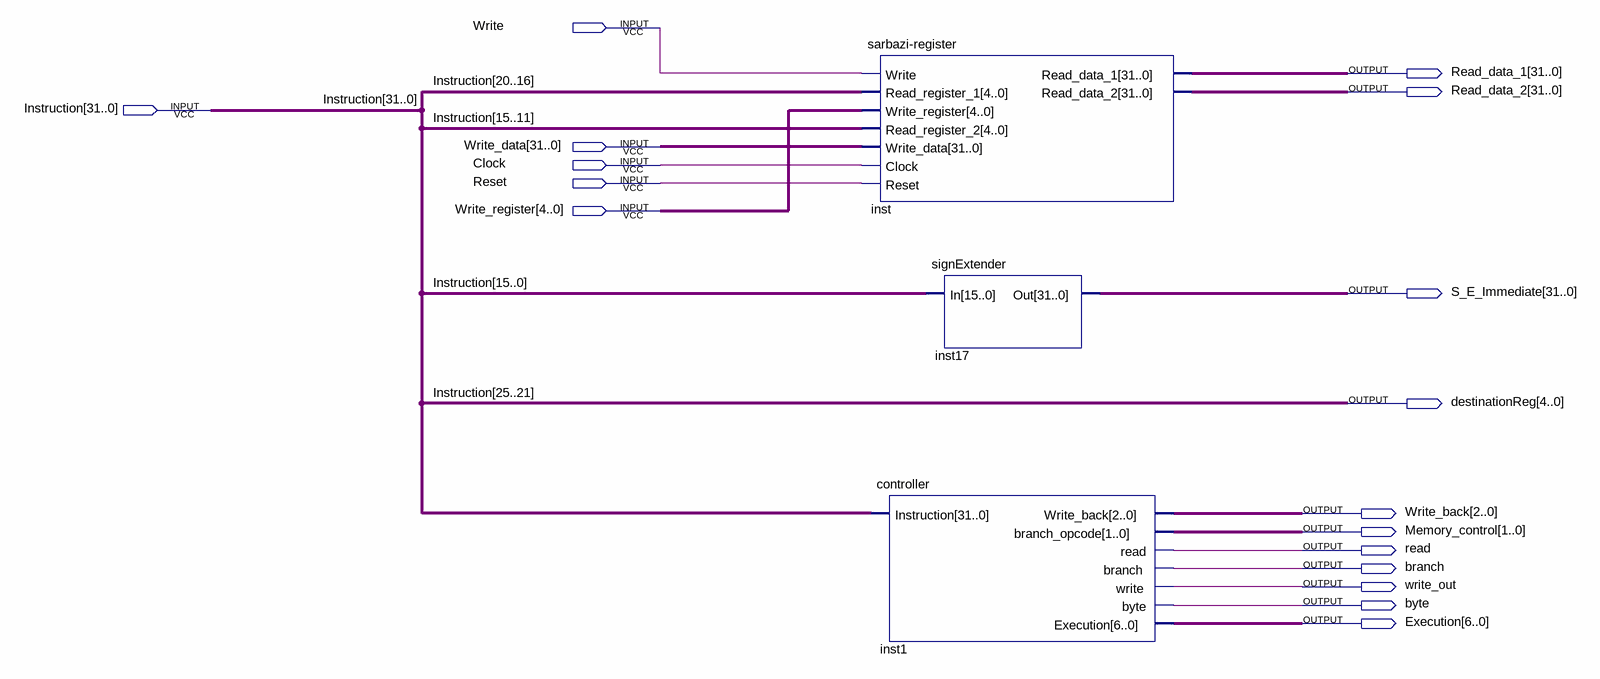
[diagram p0: schematic sheet]
// Quartus schematic instDecodeLEVEL.bdf as structural Verilog: 3 symbols, 17 pins
module instDecodeLEVEL (
  input  Write,
  input  [31:0] Instruction,
  input  [31:0] Write_data,
  input  Clock,
  input  Reset,
  input  [4:0] Write_register,
  output [31:0] Read_data_1,
  output [31:0] Read_data_2,
  output [31:0] S_E_Immediate,
  output [4:0] destinationReg,
  output [2:0] Write_back,
  output [1:0] Memory_control,
  output read,
  output branch,
  output write_out,
  output \byte ,
  output [6:0] Execution
);

  \sarbazi-register  inst (
    .Write(Write), .Read_register_1(Instruction[20:16]), .Write_register(Write_register),
    .Read_register_2(Instruction[15:11]), .Write_data(Write_data), .Clock(Clock), .Reset(Reset),
    .Read_data_1(Read_data_1), .Read_data_2(Read_data_2));
  controller inst1 (
    .Instruction(Instruction), .Write_back(Write_back), .branch_opcode(Memory_control), .read(read),
    .branch(branch), .write(write_out), .\byte (\byte ), .Execution(Execution));
  signExtender inst17 (.In(Instruction[15:0]), .Out(S_E_Immediate));

  assign destinationReg = Instruction[25:21];
endmodule
